# Altium schematic sheet powerDist.SchDoc
size E; SheetNumber: 3; SheetTotal: 4
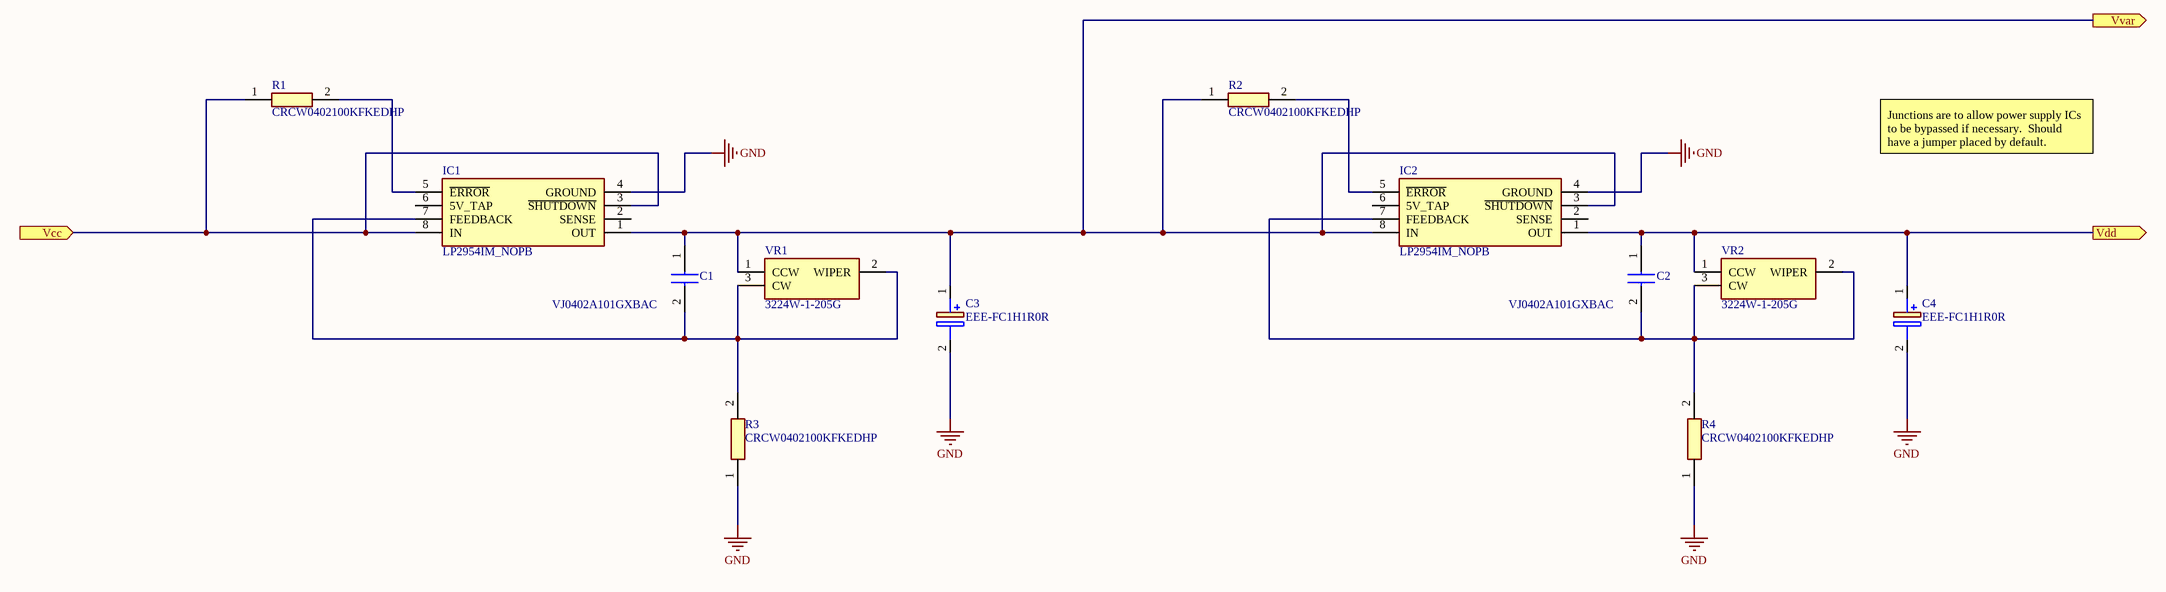
[diagram p0: powerDist.SchDoc]

## Parts
C1  VJ0402A101GXBAC  [CAPC1005X55N]
C2  VJ0402A101GXBAC  [CAPC1005X55N]
C3  EEE-FC1H1R0R  [EEE1AA220WR]
C4  EEE-FC1H1R0R  [EEE1AA220WR]
IC1  LP2954IM_NOPB  [SOIC127P600X175-8N]
IC2  LP2954IM_NOPB  [SOIC127P600X175-8N]
R1  CRCW0402100KFKEDHP  [RESC1005X40N]
R2  CRCW0402100KFKEDHP  [RESC1005X40N]
R3  CRCW0402100KFKEDHP  [RESC1005X40N]
R4  CRCW0402100KFKEDHP  [RESC1005X40N]
VR1  3224W-1-205G  [3224W1205G]
VR2  3224W-1-205G  [3224W1205G]

## Ports
Vcc (in), Vdd (out), Vvar (out)

## Nets
GND: C3.2(-) C4.2(-) IC1.4(GROUND) IC2.4(GROUND) R3.1 R4.1
Vcc: IC1.3(~{SHUTDOWN}) IC1.8(IN) R1.1 ; port Vcc
Vdd: C2.1 C4.1(+) IC2.1(OUT) VR2.1(CCW) ; port Vdd
Vvar: C1.1 C3.1(+) IC1.1(OUT) IC2.3(~{SHUTDOWN}) IC2.8(IN) R2.1 VR1.1(CCW) ; port Vvar
NetC1_2: C1.2 IC1.7(FEEDBACK) R3.2 VR1.2(WIPER) VR1.3(CW)
NetC2_2: C2.2 IC2.7(FEEDBACK) R4.2 VR2.2(WIPER) VR2.3(CW)
NetIC1_5: IC1.5(~{ERROR}) R1.2
NetIC2_5: IC2.5(~{ERROR}) R2.2

Not connected (* = marked no-connect by the designer): IC1 2(SENSE) 6(5V_TAP); IC2 2(SENSE) 6(5V_TAP)

## Notes on the sheet
- Junctions are to allow power supply ICs to be bypassed if necessary.  Should have a jumper placed by default.

## Library data of the parts
C1 C2 = VJ0402A101GXBAC: Capacitor; Manufacturer_Name: Vishay; Datasheet Link: http://www.vishay.com/docs/45226/vj31xrohsautomlcc.pdf; Height: 0.55mm; Manufacturer_Part_Number: VJ0402A101GXBAC; Mouser Part Number: 77-VJ0402A101GXBAC; Mouser Price/Stock: https://www.mouser.com/Search/Refine.aspx?Keyword=77-VJ0402A101GXBAC
C3 C4 = EEE-FC1H1R0R: Capacitor Polarised; Manufacturer_Name: Panasonic; Datasheet Link: http://industrial.panasonic.com/cdbs/www-data/pdf/RDE0000/ABA0000C1172.pdf; Height: 5.5mm; Manufacturer_Part_Number: EEE-FC1H1R0R
IC1 IC2 = LP2954IM_NOPB: Integrated Circuit; Manufacturer_Name: Texas Instruments; Manufacturer_Part_Number: LP2954IM/NOPB; Datasheet Link: http://www.ti.com/lit/ds/symlink/lp2954.pdf; Height: 1.75mm; Mouser Part Number: 926-LP2954IM/NOPB; Mouser Price/Stock: https://www.mouser.co.uk/ProductDetail/Texas-Instruments/LP2954IM-NOPB?qs=7lkVKPoqpbabRBZ4oJW1Cw%3D%3D; Arrow Part Number: LP2954IM/NOPB; Arrow Price/Stock: https://www.arrow.com/en/products/lp2954imnopb/texas-instruments
R1-R4 = CRCW0402100KFKEDHP: Resistor; Manufacturer_Name: Vishay; Datasheet Link: http://www.vishay.com/docs/20035/dcrcwe3.pdf; Height: 0.4mm; Manufacturer_Part_Number: CRCW0402100KFKEDHP; Mouser Part Number: 71-CRCW0402100KFKEDH; Mouser Price/Stock: https://www.mouser.co.uk/ProductDetail/Vishay-Dale/CRCW0402100KFKEDHP?qs=k2%2FDWSARqgGFakjlJe4Ejw%3D%3D; Arrow Part Number: CRCW0402100KFKEDHP; Arrow Price/Stock: https://www.arrow.com/en/products/crcw0402100kfkedhp/vishay?region=nac
VR1 VR2 = 3224W-1-205G: Variable Resistor; Manufacturer_Name: Bourns; Datasheet Link: https://componentsearchengine.com/Datasheets/1/3224W-1-205G.pdf; Height: 5.3mm; Manufacturer_Part_Number: 3224W-1-205G; Mouser Part Number: 652-3224W-1-205G; Mouser Price/Stock: https://www.mouser.co.uk/ProductDetail/Bourns/3224W-1-205G?qs=ex25RYyDdK9tk4UnpJ5t%2Fg%3D%3D